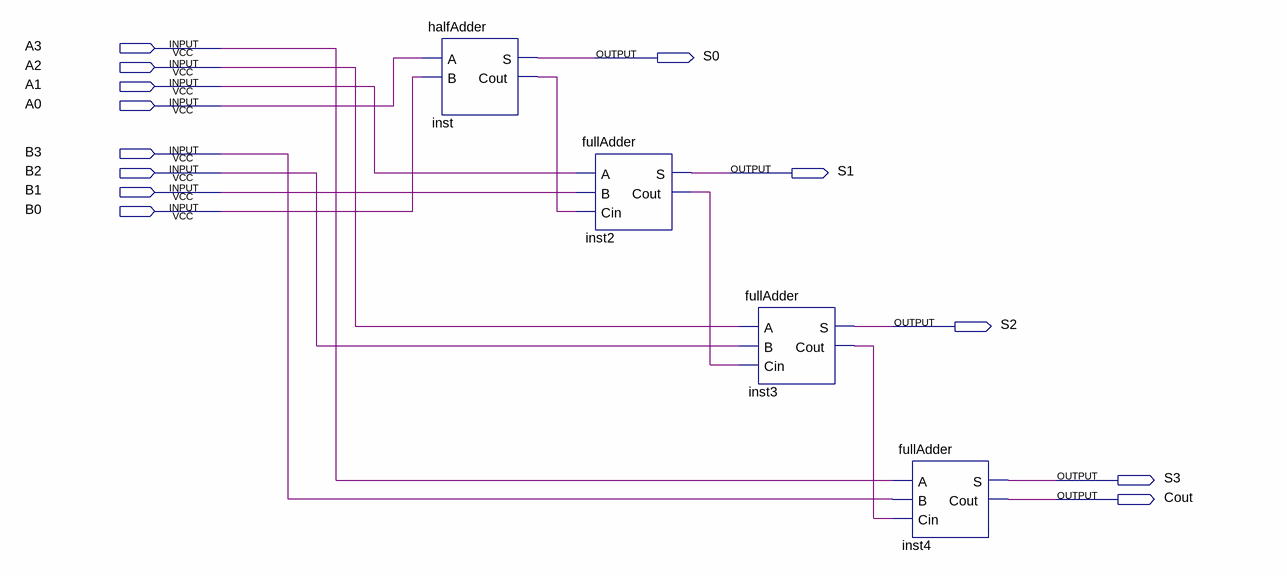
[diagram p0: schematic sheet]
// Quartus schematic addr4Bits.bdf as structural Verilog: 4 symbols, 13 pins
module addr4Bits (
  input  A3,
  input  A2,
  input  A1,
  input  A0,
  input  B3,
  input  B2,
  input  B1,
  input  B0,
  output S0,
  output S1,
  output S2,
  output S3,
  output Cout
);

  wire inst2_cout, inst3_cout, inst_cout;

  halfAdder inst (.A(A0), .B(B0), .S(S0), .Cout(inst_cout));
  fullAdder inst2 (.A(A1), .B(B1), .Cin(inst_cout), .S(S1), .Cout(inst2_cout));
  fullAdder inst3 (.A(A2), .B(B2), .Cin(inst2_cout), .S(S2), .Cout(inst3_cout));
  fullAdder inst4 (.A(A3), .B(B3), .Cin(inst3_cout), .S(S3), .Cout(Cout));
endmodule
